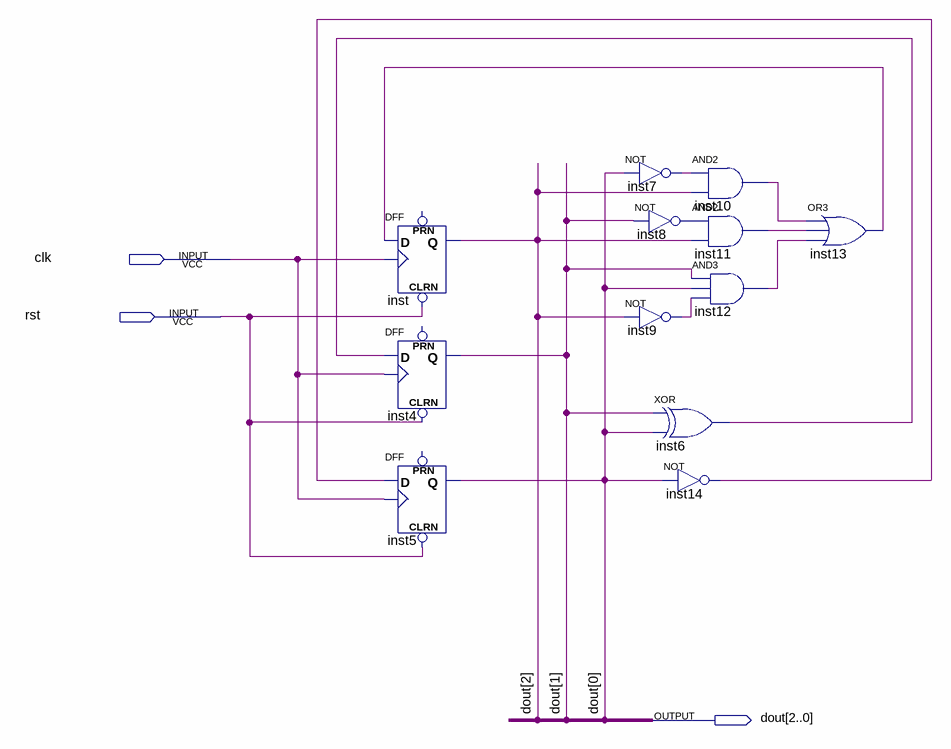
[diagram p0: schematic sheet]
// Quartus schematic count8.bdf as structural Verilog: 12 symbols, 3 pins
module count8 (
  input  clk,
  input  rst,
  output [2:0] dout
);

  wire inst6_out, inst7_out, inst8_out, inst9_out, inst10_out, inst11_out, inst12_out, inst13_out, inst14_out;

  DFF inst (.CLRN(rst), .CLK(clk), .D(inst13_out), .Q(dout[2]));  // open: PRN
  DFF inst4 (.CLRN(rst), .CLK(clk), .D(inst6_out), .Q(dout[1]));  // open: PRN
  DFF inst5 (.CLRN(rst), .CLK(clk), .D(inst14_out), .Q(dout[0]));  // open: PRN
  not inst7 (inst7_out, dout[0]);
  not inst9 (inst9_out, dout[2]);
  and inst10 (inst10_out, inst7_out, dout[2]);
  not inst8 (inst8_out, dout[1]);
  and inst11 (inst11_out, inst8_out, dout[2]);
  and inst12 (inst12_out, dout[1], dout[0], inst9_out);
  xor inst6 (inst6_out, dout[1], dout[0]);
  not inst14 (inst14_out, dout[0]);
  or inst13 (inst13_out, inst10_out, inst11_out, inst12_out);
endmodule
